# Altium schematic sheet Main.SchDoc (part 2 of 2)
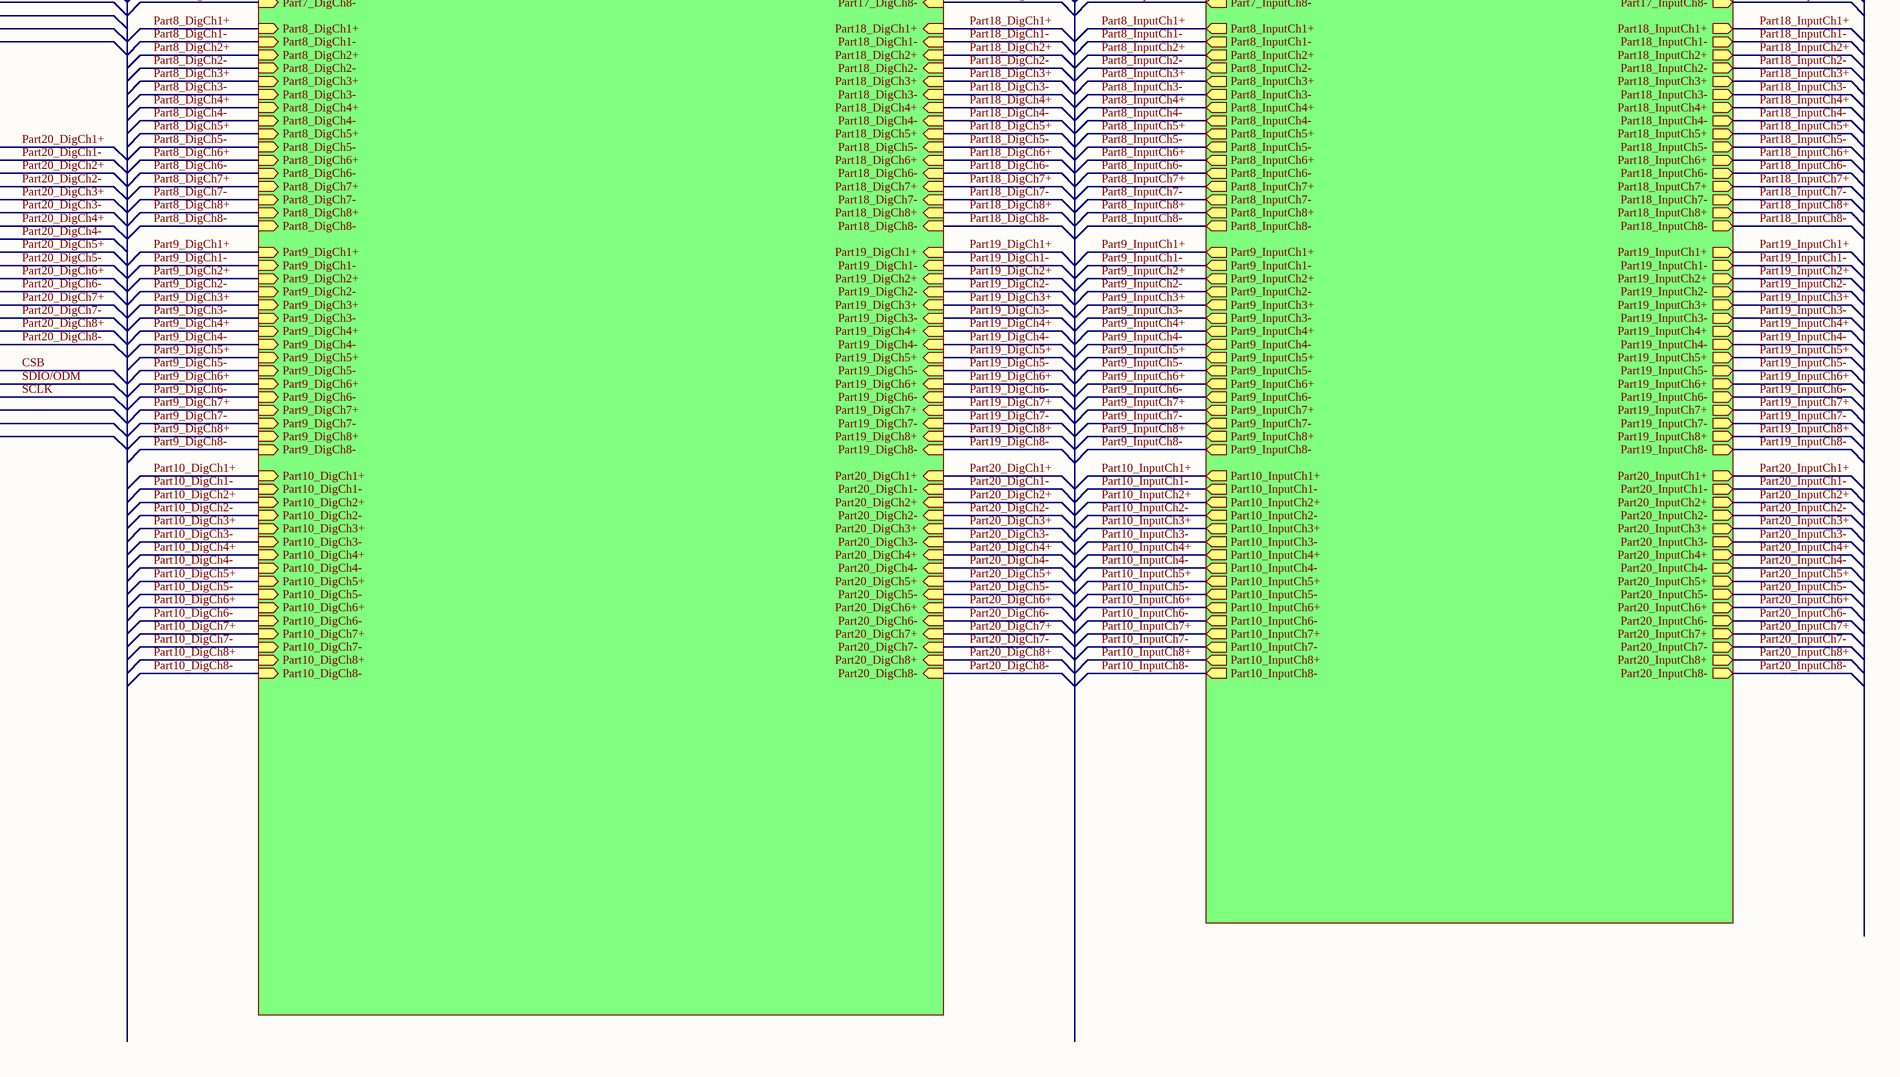
[diagram p4: Main.SchDoc, bottom right]

## Nets
CSB: sheet Part1/CSB, sheet Part5/CSB, sheet Part9/CSB, sheet Part13/CSB, sheet Part17/CSB, sheet Part2/CSB, sheet Part6/CSB, sheet Part10/CSB, sheet Part14/CSB, sheet Part18/CSB, sheet Part3/CSB, sheet Part7/CSB, sheet Part11/CSB, sheet Part15/CSB, sheet Part19/CSB, sheet Part4/CSB, sheet Part8/CSB, sheet Part12/CSB, sheet Part16/CSB, sheet Part20/CSB
Part1_DigCh1+: sheet Processing/Part1_DigCh1+, sheet Part1/Output_ch1+
Part1_DigCh1-: sheet Processing/Part1_DigCh1-, sheet Part1/Output_ch1-
Part1_DigCh2+: sheet Processing/Part1_DigCh2+, sheet Part1/Output_ch2+
Part1_DigCh2-: sheet Processing/Part1_DigCh2-, sheet Part1/Output_ch2-
Part1_DigCh3+: sheet Processing/Part1_DigCh3+, sheet Part1/Output_ch3+
Part1_DigCh3-: sheet Processing/Part1_DigCh3-, sheet Part1/Output_ch3-
Part1_DigCh4+: sheet Processing/Part1_DigCh4+, sheet Part1/Output_ch4+
Part1_DigCh4-: sheet Processing/Part1_DigCh4-, sheet Part1/Output_ch4-
Part1_DigCh5+: sheet Processing/Part1_DigCh5+, sheet Part1/Output_ch5+
Part1_DigCh5-: sheet Processing/Part1_DigCh5-, sheet Part1/Output_ch5-
Part1_DigCh6+: sheet Processing/Part1_DigCh6+, sheet Part1/Output_ch6+
Part1_DigCh6-: sheet Processing/Part1_DigCh6-, sheet Part1/Output_ch6-
Part1_DigCh7+: sheet Processing/Part1_DigCh7+, sheet Part1/Output_ch7+
Part1_DigCh7-: sheet Processing/Part1_DigCh7-, sheet Part1/Output_ch7-
Part1_DigCh8+: sheet Processing/Part1_DigCh8+, sheet Part1/Output_ch8+
Part1_DigCh8-: sheet Processing/Part1_DigCh8-, sheet Part1/Output_ch8-
Part1_InputCh1+: sheet Designator/Part1_InputCh1+, sheet Part1/Input_ch1+
Part1_InputCh1-: sheet Designator/Part1_InputCh1-, sheet Part1/Input_ch1-
Part1_InputCh2+: sheet Designator/Part1_InputCh2+, sheet Part1/Input_ch2+
Part1_InputCh2-: sheet Designator/Part1_InputCh2-, sheet Part1/Input_ch2-
Part1_InputCh3+: sheet Designator/Part1_InputCh3+, sheet Part1/Input_ch3+
Part1_InputCh3-: sheet Designator/Part1_InputCh3-, sheet Part1/Input_ch3-
Part1_InputCh4+: sheet Designator/Part1_InputCh4+, sheet Part1/Input_ch4+
Part1_InputCh4-: sheet Designator/Part1_InputCh4-, sheet Part1/Input_ch4-
Part1_InputCh5+: sheet Designator/Part1_InputCh5+, sheet Part1/Input_ch5+
Part1_InputCh5-: sheet Designator/Part1_InputCh5-, sheet Part1/Input_ch5-
Part1_InputCh6+: sheet Designator/Part1_InputCh6+, sheet Part1/Input_ch6+
Part1_InputCh6-: sheet Designator/Part1_InputCh6-, sheet Part1/Input_ch6-
Part1_InputCh7+: sheet Designator/Part1_InputCh7+, sheet Part1/Input_ch7+
Part1_InputCh7-: sheet Designator/Part1_InputCh7-, sheet Part1/Input_ch7-
Part1_InputCh8+: sheet Designator/Part1_InputCh8+, sheet Part1/Input_ch8+
Part1_InputCh8-: sheet Designator/Part1_InputCh8-, sheet Part1/Input_ch8-
Part2_DigCh1+: sheet Processing/Part2_DigCh1+, sheet Part2/Output_ch1+
Part2_DigCh1-: sheet Processing/Part2_DigCh1-, sheet Part2/Output_ch1-
Part2_DigCh2+: sheet Processing/Part2_DigCh2+, sheet Part2/Output_ch2+
Part2_DigCh2-: sheet Processing/Part2_DigCh2-, sheet Part2/Output_ch2-
Part2_DigCh3+: sheet Processing/Part2_DigCh3+, sheet Part2/Output_ch3+
Part2_DigCh3-: sheet Processing/Part2_DigCh3-, sheet Part2/Output_ch3-
Part2_DigCh4+: sheet Processing/Part2_DigCh4+, sheet Part2/Output_ch4+
Part2_DigCh4-: sheet Processing/Part2_DigCh4-, sheet Part2/Output_ch4-
Part2_DigCh5+: sheet Processing/Part2_DigCh5+, sheet Part2/Output_ch5+
Part2_DigCh5-: sheet Processing/Part2_DigCh5-, sheet Part2/Output_ch5-
Part2_DigCh6+: sheet Processing/Part2_DigCh6+, sheet Part2/Output_ch6+
Part2_DigCh6-: sheet Processing/Part2_DigCh6-, sheet Part2/Output_ch6-
Part2_DigCh7+: sheet Processing/Part2_DigCh7+, sheet Part2/Output_ch7+
Part2_DigCh7-: sheet Processing/Part2_DigCh7-, sheet Part2/Output_ch7-
Part2_DigCh8+: sheet Processing/Part2_DigCh8+, sheet Part2/Output_ch8+
Part2_DigCh8-: sheet Processing/Part2_DigCh8-, sheet Part2/Output_ch8-
Part2_InputCh1+: sheet Designator/Part2_InputCh1+, sheet Part2/Input_ch1+
Part2_InputCh1-: sheet Designator/Part2_InputCh1-, sheet Part2/Input_ch1-
Part2_InputCh2+: sheet Designator/Part2_InputCh2+, sheet Part2/Input_ch2+
Part2_InputCh2-: sheet Designator/Part2_InputCh2-, sheet Part2/Input_ch2-
Part2_InputCh3+: sheet Designator/Part2_InputCh3+, sheet Part2/Input_ch3+
Part2_InputCh3-: sheet Designator/Part2_InputCh3-, sheet Part2/Input_ch3-
Part2_InputCh4+: sheet Designator/Part2_InputCh4+, sheet Part2/Input_ch4+
Part2_InputCh4-: sheet Designator/Part2_InputCh4-, sheet Part2/Input_ch4-
Part2_InputCh5+: sheet Designator/Part2_InputCh5+, sheet Part2/Input_ch5+
Part2_InputCh5-: sheet Designator/Part2_InputCh5-, sheet Part2/Input_ch5-
Part2_InputCh6+: sheet Designator/Part2_InputCh6+, sheet Part2/Input_ch6+
Part2_InputCh6-: sheet Designator/Part2_InputCh6-, sheet Part2/Input_ch6-
Part2_InputCh7+: sheet Designator/Part2_InputCh7+, sheet Part2/Input_ch7+
Part2_InputCh7-: sheet Designator/Part2_InputCh7-, sheet Part2/Input_ch7-
Part2_InputCh8+: sheet Designator/Part2_InputCh8+, sheet Part2/Input_ch8+
Part2_InputCh8-: sheet Designator/Part2_InputCh8-, sheet Part2/Input_ch8-
Part3_DigCh1+: sheet Processing/Part3_DigCh1+, sheet Part3/Output_ch1+
Part3_DigCh1-: sheet Processing/Part3_DigCh1-, sheet Part3/Output_ch1-
Part3_DigCh2+: sheet Processing/Part3_DigCh2+, sheet Part3/Output_ch2+
Part3_DigCh2-: sheet Processing/Part3_DigCh2-, sheet Part3/Output_ch2-
Part3_DigCh3+: sheet Processing/Part3_DigCh3+, sheet Part3/Output_ch3+
Part3_DigCh3-: sheet Processing/Part3_DigCh3-, sheet Part3/Output_ch3-
Part3_DigCh4+: sheet Processing/Part3_DigCh4+, sheet Part3/Output_ch4+
Part3_DigCh4-: sheet Processing/Part3_DigCh4-, sheet Part3/Output_ch4-
Part3_DigCh5+: sheet Processing/Part3_DigCh5+, sheet Part3/Output_ch5+
Part3_DigCh5-: sheet Processing/Part3_DigCh5-, sheet Part3/Output_ch5-
Part3_DigCh6+: sheet Processing/Part3_DigCh6+, sheet Part3/Output_ch6+
Part3_DigCh6-: sheet Processing/Part3_DigCh6-, sheet Part3/Output_ch6-
Part3_DigCh7+: sheet Processing/Part3_DigCh7+, sheet Part3/Output_ch7+
Part3_DigCh7-: sheet Processing/Part3_DigCh7-, sheet Part3/Output_ch7-
Part3_DigCh8+: sheet Processing/Part3_DigCh8+, sheet Part3/Output_ch8+
Part3_DigCh8-: sheet Processing/Part3_DigCh8-, sheet Part3/Output_ch8-
Part3_InputCh1+: sheet Designator/Part3_InputCh1+, sheet Part3/Input_ch1+
Part3_InputCh1-: sheet Designator/Part3_InputCh1-, sheet Part3/Input_ch1-
Part3_InputCh2+: sheet Designator/Part3_InputCh2+, sheet Part3/Input_ch2+
Part3_InputCh2-: sheet Designator/Part3_InputCh2-, sheet Part3/Input_ch2-
Part3_InputCh3+: sheet Designator/Part3_InputCh3+, sheet Part3/Input_ch3+
Part3_InputCh3-: sheet Designator/Part3_InputCh3-, sheet Part3/Input_ch3-
Part3_InputCh4+: sheet Designator/Part3_InputCh4+, sheet Part3/Input_ch4+
Part3_InputCh4-: sheet Designator/Part3_InputCh4-, sheet Part3/Input_ch4-
Part3_InputCh5+: sheet Designator/Part3_InputCh5+, sheet Part3/Input_ch5+
Part3_InputCh5-: sheet Designator/Part3_InputCh5-, sheet Part3/Input_ch5-
Part3_InputCh6+: sheet Designator/Part3_InputCh6+, sheet Part3/Input_ch6+
Part3_InputCh6-: sheet Designator/Part3_InputCh6-, sheet Part3/Input_ch6-
Part3_InputCh7+: sheet Designator/Part3_InputCh7+, sheet Part3/Input_ch7+
Part3_InputCh7-: sheet Designator/Part3_InputCh7-, sheet Part3/Input_ch7-
Part3_InputCh8+: sheet Designator/Part3_InputCh8+, sheet Part3/Input_ch8+
Part3_InputCh8-: sheet Designator/Part3_InputCh8-, sheet Part3/Input_ch8-
Part4_DigCh1+: sheet Processing/Part4_DigCh1+, sheet Part4/Output_ch1+
Part4_DigCh1-: sheet Processing/Part4_DigCh1-, sheet Part4/Output_ch1-
Part4_DigCh2+: sheet Processing/Part4_DigCh2+, sheet Part4/Output_ch2+
Part4_DigCh2-: sheet Processing/Part4_DigCh2-, sheet Part4/Output_ch2-
Part4_DigCh3+: sheet Processing/Part4_DigCh3+, sheet Part4/Output_ch3+
Part4_DigCh3-: sheet Processing/Part4_DigCh3-, sheet Part4/Output_ch3-
Part4_DigCh4+: sheet Processing/Part4_DigCh4+, sheet Part4/Output_ch4+
Part4_DigCh4-: sheet Processing/Part4_DigCh4-, sheet Part4/Output_ch4-
Part4_DigCh5+: sheet Processing/Part4_DigCh5+, sheet Part4/Output_ch5+
Part4_DigCh5-: sheet Processing/Part4_DigCh5-, sheet Part4/Output_ch5-
Part4_DigCh6+: sheet Processing/Part4_DigCh6+, sheet Part4/Output_ch6+
Part4_DigCh6-: sheet Processing/Part4_DigCh6-, sheet Part4/Output_ch6-
Part4_DigCh7+: sheet Processing/Part4_DigCh7+, sheet Part4/Output_ch7+
Part4_DigCh7-: sheet Processing/Part4_DigCh7-, sheet Part4/Output_ch7-
Part4_DigCh8+: sheet Processing/Part4_DigCh8+, sheet Part4/Output_ch8+
Part4_DigCh8-: sheet Processing/Part4_DigCh8-, sheet Part4/Output_ch8-
Part4_InputCh1+: sheet Designator/Part4_InputCh1+, sheet Part4/Input_ch1+
Part4_InputCh1-: sheet Designator/Part4_InputCh1-, sheet Part4/Input_ch1-
Part4_InputCh2+: sheet Designator/Part4_InputCh2+, sheet Part4/Input_ch2+
Part4_InputCh2-: sheet Designator/Part4_InputCh2-, sheet Part4/Input_ch2-
Part4_InputCh3+: sheet Designator/Part4_InputCh3+, sheet Part4/Input_ch3+
Part4_InputCh3-: sheet Designator/Part4_InputCh3-, sheet Part4/Input_ch3-
Part4_InputCh4+: sheet Designator/Part4_InputCh4+, sheet Part4/Input_ch4+
Part4_InputCh4-: sheet Designator/Part4_InputCh4-, sheet Part4/Input_ch4-
Part4_InputCh5+: sheet Designator/Part4_InputCh5+, sheet Part4/Input_ch5+
Part4_InputCh5-: sheet Designator/Part4_InputCh5-, sheet Part4/Input_ch5-
Part4_InputCh6+: sheet Designator/Part4_InputCh6+, sheet Part4/Input_ch6+
Part4_InputCh6-: sheet Designator/Part4_InputCh6-, sheet Part4/Input_ch6-
Part4_InputCh7+: sheet Designator/Part4_InputCh7+, sheet Part4/Input_ch7+
Part4_InputCh7-: sheet Designator/Part4_InputCh7-, sheet Part4/Input_ch7-
Part4_InputCh8+: sheet Designator/Part4_InputCh8+, sheet Part4/Input_ch8+
Part4_InputCh8-: sheet Designator/Part4_InputCh8-, sheet Part4/Input_ch8-
Part5_DigCh1+: sheet Processing/Part5_DigCh1+, sheet Part5/Output_ch1+
Part5_DigCh1-: sheet Processing/Part5_DigCh1-, sheet Part5/Output_ch1-
Part5_DigCh2+: sheet Processing/Part5_DigCh2+, sheet Part5/Output_ch2+
Part5_DigCh2-: sheet Processing/Part5_DigCh2-, sheet Part5/Output_ch2-
Part5_DigCh3+: sheet Processing/Part5_DigCh3+, sheet Part5/Output_ch3+
Part5_DigCh3-: sheet Processing/Part5_DigCh3-, sheet Part5/Output_ch3-
Part5_DigCh4+: sheet Processing/Part5_DigCh4+, sheet Part5/Output_ch4+
Part5_DigCh4-: sheet Processing/Part5_DigCh4-, sheet Part5/Output_ch4-
Part5_DigCh5+: sheet Processing/Part5_DigCh5+, sheet Part5/Output_ch5+
Part5_DigCh5-: sheet Processing/Part5_DigCh5-, sheet Part5/Output_ch5-
Part5_DigCh6+: sheet Processing/Part5_DigCh6+, sheet Part5/Output_ch6+
Part5_DigCh6-: sheet Processing/Part5_DigCh6-, sheet Part5/Output_ch6-
Part5_DigCh7+: sheet Processing/Part5_DigCh7+, sheet Part5/Output_ch7+
Part5_DigCh7-: sheet Processing/Part5_DigCh7-, sheet Part5/Output_ch7-
Part5_DigCh8+: sheet Processing/Part5_DigCh8+, sheet Part5/Output_ch8+
Part5_DigCh8-: sheet Processing/Part5_DigCh8-, sheet Part5/Output_ch8-
Part5_InputCh1+: sheet Designator/Part5_InputCh1+, sheet Part5/Input_ch1+
Part5_InputCh1-: sheet Designator/Part5_InputCh1-, sheet Part5/Input_ch1-
Part5_InputCh2+: sheet Designator/Part5_InputCh2+, sheet Part5/Input_ch2+
Part5_InputCh2-: sheet Designator/Part5_InputCh2-, sheet Part5/Input_ch2-
Part5_InputCh3+: sheet Designator/Part5_InputCh3+, sheet Part5/Input_ch3+
Part5_InputCh3-: sheet Designator/Part5_InputCh3-, sheet Part5/Input_ch3-
Part5_InputCh4+: sheet Designator/Part5_InputCh4+, sheet Part5/Input_ch4+
Part5_InputCh4-: sheet Designator/Part5_InputCh4-, sheet Part5/Input_ch4-
Part5_InputCh5+: sheet Designator/Part5_InputCh5+, sheet Part5/Input_ch5+
Part5_InputCh5-: sheet Designator/Part5_InputCh5-, sheet Part5/Input_ch5-
Part5_InputCh6+: sheet Designator/Part5_InputCh6+, sheet Part5/Input_ch6+
Part5_InputCh6-: sheet Designator/Part5_InputCh6-, sheet Part5/Input_ch6-
Part5_InputCh7+: sheet Designator/Part5_InputCh7+, sheet Part5/Input_ch7+
Part5_InputCh7-: sheet Designator/Part5_InputCh7-, sheet Part5/Input_ch7-
Part5_InputCh8+: sheet Designator/Part5_InputCh8+, sheet Part5/Input_ch8+
Part5_InputCh8-: sheet Designator/Part5_InputCh8-, sheet Part5/Input_ch8-
Part6_DigCh1+: sheet Processing/Part6_DigCh1+, sheet Part6/Output_ch1+
Part6_DigCh1-: sheet Processing/Part6_DigCh1-, sheet Part6/Output_ch1-
Part6_DigCh2+: sheet Processing/Part6_DigCh2+, sheet Part6/Output_ch2+
Part6_DigCh2-: sheet Processing/Part6_DigCh2-, sheet Part6/Output_ch2-
Part6_DigCh3+: sheet Processing/Part6_DigCh3+, sheet Part6/Output_ch3+
Part6_DigCh3-: sheet Processing/Part6_DigCh3-, sheet Part6/Output_ch3-
Part6_DigCh4+: sheet Processing/Part6_DigCh4+, sheet Part6/Output_ch4+
Part6_DigCh4-: sheet Processing/Part6_DigCh4-, sheet Part6/Output_ch4-
Part6_DigCh5+: sheet Processing/Part6_DigCh5+, sheet Part6/Output_ch5+
Part6_DigCh5-: sheet Processing/Part6_DigCh5-, sheet Part6/Output_ch5-
Part6_DigCh6+: sheet Processing/Part6_DigCh6+, sheet Part6/Output_ch6+
Part6_DigCh6-: sheet Processing/Part6_DigCh6-, sheet Part6/Output_ch6-
Part6_DigCh7+: sheet Processing/Part6_DigCh7+, sheet Part6/Output_ch7+
Part6_DigCh7-: sheet Processing/Part6_DigCh7-, sheet Part6/Output_ch7-
Part6_DigCh8+: sheet Processing/Part6_DigCh8+, sheet Part6/Output_ch8+
Part6_DigCh8-: sheet Processing/Part6_DigCh8-, sheet Part6/Output_ch8-
Part6_InputCh1+: sheet Designator/Part6_InputCh1+, sheet Part6/Input_ch1+
Part6_InputCh1-: sheet Designator/Part6_InputCh1-, sheet Part6/Input_ch1-
Part6_InputCh2+: sheet Designator/Part6_InputCh2+, sheet Part6/Input_ch2+
Part6_InputCh2-: sheet Designator/Part6_InputCh2-, sheet Part6/Input_ch2-
Part6_InputCh3+: sheet Designator/Part6_InputCh3+, sheet Part6/Input_ch3+
Part6_InputCh3-: sheet Designator/Part6_InputCh3-, sheet Part6/Input_ch3-
Part6_InputCh4+: sheet Designator/Part6_InputCh4+, sheet Part6/Input_ch4+
Part6_InputCh4-: sheet Designator/Part6_InputCh4-, sheet Part6/Input_ch4-
Part6_InputCh5+: sheet Designator/Part6_InputCh5+, sheet Part6/Input_ch5+
Part6_InputCh5-: sheet Designator/Part6_InputCh5-, sheet Part6/Input_ch5-
Part6_InputCh6+: sheet Designator/Part6_InputCh6+, sheet Part6/Input_ch6+
Part6_InputCh6-: sheet Designator/Part6_InputCh6-, sheet Part6/Input_ch6-
Part6_InputCh7+: sheet Designator/Part6_InputCh7+, sheet Part6/Input_ch7+
Part6_InputCh7-: sheet Designator/Part6_InputCh7-, sheet Part6/Input_ch7-
Part6_InputCh8+: sheet Designator/Part6_InputCh8+, sheet Part6/Input_ch8+
Part6_InputCh8-: sheet Designator/Part6_InputCh8-, sheet Part6/Input_ch8-
Part7_DigCh1+: sheet Processing/Part7_DigCh1+, sheet Part7/Output_ch1+
Part7_DigCh1-: sheet Processing/Part7_DigCh1-, sheet Part7/Output_ch1-
Part7_DigCh2+: sheet Processing/Part7_DigCh2+, sheet Part7/Output_ch2+
Part7_DigCh2-: sheet Processing/Part7_DigCh2-, sheet Part7/Output_ch2-
Part7_DigCh3+: sheet Processing/Part7_DigCh3+, sheet Part7/Output_ch3+
Part7_DigCh3-: sheet Processing/Part7_DigCh3-, sheet Part7/Output_ch3-
Part7_DigCh4+: sheet Processing/Part7_DigCh4+, sheet Part7/Output_ch4+
Part7_DigCh4-: sheet Processing/Part7_DigCh4-, sheet Part7/Output_ch4-
Part7_DigCh5+: sheet Processing/Part7_DigCh5+, sheet Part7/Output_ch5+
Part7_DigCh5-: sheet Processing/Part7_DigCh5-, sheet Part7/Output_ch5-
Part7_DigCh6+: sheet Processing/Part7_DigCh6+, sheet Part7/Output_ch6+
Part7_DigCh6-: sheet Processing/Part7_DigCh6-, sheet Part7/Output_ch6-
Part7_DigCh7+: sheet Processing/Part7_DigCh7+, sheet Part7/Output_ch7+
Part7_DigCh7-: sheet Processing/Part7_DigCh7-, sheet Part7/Output_ch7-
Part7_DigCh8+: sheet Processing/Part7_DigCh8+, sheet Part7/Output_ch8+
Part7_DigCh8-: sheet Processing/Part7_DigCh8-, sheet Part7/Output_ch8-
Part7_InputCh1+: sheet Designator/Part7_InputCh1+, sheet Part7/Input_ch1+
Part7_InputCh1-: sheet Designator/Part7_InputCh1-, sheet Part7/Input_ch1-
Part7_InputCh2+: sheet Designator/Part7_InputCh2+, sheet Part7/Input_ch2+
Part7_InputCh2-: sheet Designator/Part7_InputCh2-, sheet Part7/Input_ch2-
Part7_InputCh3+: sheet Designator/Part7_InputCh3+, sheet Part7/Input_ch3+
Part7_InputCh3-: sheet Designator/Part7_InputCh3-, sheet Part7/Input_ch3-
Part7_InputCh4+: sheet Designator/Part7_InputCh4+, sheet Part7/Input_ch4+
Part7_InputCh4-: sheet Designator/Part7_InputCh4-, sheet Part7/Input_ch4-
Part7_InputCh5+: sheet Designator/Part7_InputCh5+, sheet Part7/Input_ch5+
Part7_InputCh5-: sheet Designator/Part7_InputCh5-, sheet Part7/Input_ch5-
Part7_InputCh6+: sheet Designator/Part7_InputCh6+, sheet Part7/Input_ch6+
Part7_InputCh6-: sheet Designator/Part7_InputCh6-, sheet Part7/Input_ch6-
Part7_InputCh7+: sheet Designator/Part7_InputCh7+, sheet Part7/Input_ch7+
Part7_InputCh7-: sheet Designator/Part7_InputCh7-, sheet Part7/Input_ch7-
Part7_InputCh8+: sheet Designator/Part7_InputCh8+, sheet Part7/Input_ch8+
Part7_InputCh8-: sheet Designator/Part7_InputCh8-, sheet Part7/Input_ch8-
Part8_DigCh1+: sheet Processing/Part8_DigCh1+, sheet Part8/Output_ch1+
Part8_DigCh1-: sheet Processing/Part8_DigCh1-, sheet Part8/Output_ch1-
Part8_DigCh2+: sheet Processing/Part8_DigCh2+, sheet Part8/Output_ch2+
Part8_DigCh2-: sheet Processing/Part8_DigCh2-, sheet Part8/Output_ch2-
Part8_DigCh3+: sheet Processing/Part8_DigCh3+, sheet Part8/Output_ch3+
Part8_DigCh3-: sheet Processing/Part8_DigCh3-, sheet Part8/Output_ch3-
Part8_DigCh4+: sheet Processing/Part8_DigCh4+, sheet Part8/Output_ch4+
Part8_DigCh4-: sheet Processing/Part8_DigCh4-, sheet Part8/Output_ch4-
Part8_DigCh5+: sheet Processing/Part8_DigCh5+, sheet Part8/Output_ch5+
Part8_DigCh5-: sheet Processing/Part8_DigCh5-, sheet Part8/Output_ch5-
Part8_DigCh6+: sheet Processing/Part8_DigCh6+, sheet Part8/Output_ch6+
Part8_DigCh6-: sheet Processing/Part8_DigCh6-, sheet Part8/Output_ch6-
Part8_DigCh7+: sheet Processing/Part8_DigCh7+, sheet Part8/Output_ch7+
Part8_DigCh7-: sheet Processing/Part8_DigCh7-, sheet Part8/Output_ch7-
Part8_DigCh8+: sheet Processing/Part8_DigCh8+, sheet Part8/Output_ch8+
Part8_DigCh8-: sheet Processing/Part8_DigCh8-, sheet Part8/Output_ch8-
Part8_InputCh1+: sheet Designator/Part8_InputCh1+, sheet Part8/Input_ch1+
Part8_InputCh1-: sheet Designator/Part8_InputCh1-, sheet Part8/Input_ch1-
Part8_InputCh2+: sheet Designator/Part8_InputCh2+, sheet Part8/Input_ch2+
Part8_InputCh2-: sheet Designator/Part8_InputCh2-, sheet Part8/Input_ch2-
Part8_InputCh3+: sheet Designator/Part8_InputCh3+, sheet Part8/Input_ch3+
Part8_InputCh3-: sheet Designator/Part8_InputCh3-, sheet Part8/Input_ch3-
Part8_InputCh4+: sheet Designator/Part8_InputCh4+, sheet Part8/Input_ch4+
Part8_InputCh4-: sheet Designator/Part8_InputCh4-, sheet Part8/Input_ch4-
Part8_InputCh5+: sheet Designator/Part8_InputCh5+, sheet Part8/Input_ch5+
Part8_InputCh5-: sheet Designator/Part8_InputCh5-, sheet Part8/Input_ch5-
Part8_InputCh6+: sheet Designator/Part8_InputCh6+, sheet Part8/Input_ch6+
Part8_InputCh6-: sheet Designator/Part8_InputCh6-, sheet Part8/Input_ch6-
Part8_InputCh7+: sheet Designator/Part8_InputCh7+, sheet Part8/Input_ch7+
Part8_InputCh7-: sheet Designator/Part8_InputCh7-, sheet Part8/Input_ch7-
Part8_InputCh8+: sheet Designator/Part8_InputCh8+, sheet Part8/Input_ch8+
Part8_InputCh8-: sheet Designator/Part8_InputCh8-, sheet Part8/Input_ch8-
Part9_DigCh1+: sheet Processing/Part9_DigCh1+, sheet Part9/Output_ch1+
Part9_DigCh1-: sheet Processing/Part9_DigCh1-, sheet Part9/Output_ch1-
Part9_DigCh2+: sheet Processing/Part9_DigCh2+, sheet Part9/Output_ch2+
Part9_DigCh2-: sheet Processing/Part9_DigCh2-, sheet Part9/Output_ch2-
Part9_DigCh3+: sheet Processing/Part9_DigCh3+, sheet Part9/Output_ch3+
Part9_DigCh3-: sheet Processing/Part9_DigCh3-, sheet Part9/Output_ch3-
Part9_DigCh4+: sheet Processing/Part9_DigCh4+, sheet Part9/Output_ch4+
Part9_DigCh4-: sheet Processing/Part9_DigCh4-, sheet Part9/Output_ch4-
Part9_DigCh5+: sheet Processing/Part9_DigCh5+, sheet Part9/Output_ch5+
Part9_DigCh5-: sheet Processing/Part9_DigCh5-, sheet Part9/Output_ch5-
Part9_DigCh6+: sheet Processing/Part9_DigCh6+, sheet Part9/Output_ch6+
Part9_DigCh6-: sheet Processing/Part9_DigCh6-, sheet Part9/Output_ch6-
Part9_DigCh7+: sheet Processing/Part9_DigCh7+, sheet Part9/Output_ch7+
Part9_DigCh7-: sheet Processing/Part9_DigCh7-, sheet Part9/Output_ch7-
Part9_DigCh8+: sheet Processing/Part9_DigCh8+, sheet Part9/Output_ch8+
Part9_DigCh8-: sheet Processing/Part9_DigCh8-, sheet Part9/Output_ch8-
Part9_InputCh1+: sheet Designator/Part9_InputCh1+, sheet Part9/Input_ch1+
Part9_InputCh1-: sheet Designator/Part9_InputCh1-, sheet Part9/Input_ch1-
Part9_InputCh2+: sheet Designator/Part9_InputCh2+, sheet Part9/Input_ch2+
Part9_InputCh2-: sheet Designator/Part9_InputCh2-, sheet Part9/Input_ch2-
Part9_InputCh3+: sheet Designator/Part9_InputCh3+, sheet Part9/Input_ch3+
Part9_InputCh3-: sheet Designator/Part9_InputCh3-, sheet Part9/Input_ch3-
Part9_InputCh4+: sheet Designator/Part9_InputCh4+, sheet Part9/Input_ch4+
Part9_InputCh4-: sheet Designator/Part9_InputCh4-, sheet Part9/Input_ch4-
Part9_InputCh5+: sheet Designator/Part9_InputCh5+, sheet Part9/Input_ch5+
Part9_InputCh5-: sheet Designator/Part9_InputCh5-, sheet Part9/Input_ch5-
Part9_InputCh6+: sheet Designator/Part9_InputCh6+, sheet Part9/Input_ch6+
Part9_InputCh6-: sheet Designator/Part9_InputCh6-, sheet Part9/Input_ch6-
Part9_InputCh7+: sheet Designator/Part9_InputCh7+, sheet Part9/Input_ch7+
Part9_InputCh7-: sheet Designator/Part9_InputCh7-, sheet Part9/Input_ch7-
Part9_InputCh8+: sheet Designator/Part9_InputCh8+, sheet Part9/Input_ch8+
Part9_InputCh8-: sheet Designator/Part9_InputCh8-, sheet Part9/Input_ch8-
Part10_DigCh1+: sheet Processing/Part10_DigCh1+, sheet Part10/Output_ch1+
Part10_DigCh1-: sheet Processing/Part10_DigCh1-, sheet Part10/Output_ch1-
Part10_DigCh2+: sheet Processing/Part10_DigCh2+, sheet Part10/Output_ch2+
Part10_DigCh2-: sheet Processing/Part10_DigCh2-, sheet Part10/Output_ch2-
Part10_DigCh3+: sheet Processing/Part10_DigCh3+, sheet Part10/Output_ch3+
Part10_DigCh3-: sheet Processing/Part10_DigCh3-, sheet Part10/Output_ch3-
Part10_DigCh4+: sheet Processing/Part10_DigCh4+, sheet Part10/Output_ch4+
Part10_DigCh4-: sheet Processing/Part10_DigCh4-, sheet Part10/Output_ch4-
Part10_DigCh5+: sheet Processing/Part10_DigCh5+, sheet Part10/Output_ch5+
Part10_DigCh5-: sheet Processing/Part10_DigCh5-, sheet Part10/Output_ch5-
Part10_DigCh6+: sheet Processing/Part10_DigCh6+, sheet Part10/Output_ch6+
Part10_DigCh6-: sheet Processing/Part10_DigCh6-, sheet Part10/Output_ch6-
Part10_DigCh7+: sheet Processing/Part10_DigCh7+, sheet Part10/Output_ch7+
Part10_DigCh7-: sheet Processing/Part10_DigCh7-, sheet Part10/Output_ch7-
Part10_DigCh8+: sheet Processing/Part10_DigCh8+, sheet Part10/Output_ch8+
Part10_DigCh8-: sheet Processing/Part10_DigCh8-, sheet Part10/Output_ch8-
Part10_InputCh1+: sheet Designator/Part10_InputCh1+, sheet Part10/Input_ch1+
Part10_InputCh1-: sheet Designator/Part10_InputCh1-, sheet Part10/Input_ch1-
Part10_InputCh2+: sheet Designator/Part10_InputCh2+, sheet Part10/Input_ch2+
Part10_InputCh2-: sheet Designator/Part10_InputCh2-, sheet Part10/Input_ch2-
Part10_InputCh3+: sheet Designator/Part10_InputCh3+, sheet Part10/Input_ch3+
Part10_InputCh3-: sheet Designator/Part10_InputCh3-, sheet Part10/Input_ch3-
Part10_InputCh4+: sheet Designator/Part10_InputCh4+, sheet Part10/Input_ch4+
Part10_InputCh4-: sheet Designator/Part10_InputCh4-, sheet Part10/Input_ch4-
Part10_InputCh5+: sheet Designator/Part10_InputCh5+, sheet Part10/Input_ch5+
Part10_InputCh5-: sheet Designator/Part10_InputCh5-, sheet Part10/Input_ch5-
Part10_InputCh6+: sheet Designator/Part10_InputCh6+, sheet Part10/Input_ch6+
Part10_InputCh6-: sheet Designator/Part10_InputCh6-, sheet Part10/Input_ch6-
Part10_InputCh7+: sheet Designator/Part10_InputCh7+, sheet Part10/Input_ch7+
Part10_InputCh7-: sheet Designator/Part10_InputCh7-, sheet Part10/Input_ch7-
Part10_InputCh8+: sheet Designator/Part10_InputCh8+, sheet Part10/Input_ch8+
Part10_InputCh8-: sheet Designator/Part10_InputCh8-, sheet Part10/Input_ch8-
Part11_DigCh1+: sheet Processing/Part11_DigCh1+, sheet Part11/Output_ch1+
Part11_DigCh1-: sheet Processing/Part11_DigCh1-, sheet Part11/Output_ch1-
Part11_DigCh2+: sheet Processing/Part11_DigCh2+, sheet Part11/Output_ch2+
Part11_DigCh2-: sheet Processing/Part11_DigCh2-, sheet Part11/Output_ch2-
Part11_DigCh3+: sheet Processing/Part11_DigCh3+, sheet Part11/Output_ch3+
Part11_DigCh3-: sheet Processing/Part11_DigCh3-, sheet Part11/Output_ch3-
Part11_DigCh4+: sheet Processing/Part11_DigCh4+, sheet Part11/Output_ch4+
Part11_DigCh4-: sheet Processing/Part11_DigCh4-, sheet Part11/Output_ch4-
Part11_DigCh5+: sheet Processing/Part11_DigCh5+, sheet Part11/Output_ch5+
Part11_DigCh5-: sheet Processing/Part11_DigCh5-, sheet Part11/Output_ch5-
Part11_DigCh6+: sheet Processing/Part11_DigCh6+, sheet Part11/Output_ch6+
Part11_DigCh6-: sheet Processing/Part11_DigCh6-, sheet Part11/Output_ch6-
Part11_DigCh7+: sheet Processing/Part11_DigCh7+, sheet Part11/Output_ch7+
Part11_DigCh7-: sheet Processing/Part11_DigCh7-, sheet Part11/Output_ch7-
Part11_DigCh8+: sheet Processing/Part11_DigCh8+, sheet Part11/Output_ch8+
Part11_DigCh8-: sheet Processing/Part11_DigCh8-, sheet Part11/Output_ch8-
Part11_InputCh1+: sheet Designator/Part11_InputCh1+, sheet Part11/Input_ch1+
Part11_InputCh1-: sheet Designator/Part11_InputCh1-, sheet Part11/Input_ch1-
Part11_InputCh2+: sheet Designator/Part11_InputCh2+, sheet Part11/Input_ch2+
Part11_InputCh2-: sheet Designator/Part11_InputCh2-, sheet Part11/Input_ch2-
Part11_InputCh3+: sheet Designator/Part11_InputCh3+, sheet Part11/Input_ch3+
Part11_InputCh3-: sheet Designator/Part11_InputCh3-, sheet Part11/Input_ch3-
Part11_InputCh4+: sheet Designator/Part11_InputCh4+, sheet Part11/Input_ch4+
Part11_InputCh4-: sheet Designator/Part11_InputCh4-, sheet Part11/Input_ch4-
Part11_InputCh5+: sheet Designator/Part11_InputCh5+, sheet Part11/Input_ch5+
Part11_InputCh5-: sheet Designator/Part11_InputCh5-, sheet Part11/Input_ch5-
Part11_InputCh6+: sheet Designator/Part11_InputCh6+, sheet Part11/Input_ch6+
Part11_InputCh6-: sheet Designator/Part11_InputCh6-, sheet Part11/Input_ch6-
Part11_InputCh7+: sheet Designator/Part11_InputCh7+, sheet Part11/Input_ch7+
Part11_InputCh7-: sheet Designator/Part11_InputCh7-, sheet Part11/Input_ch7-
Part11_InputCh8+: sheet Designator/Part11_InputCh8+, sheet Part11/Input_ch8+
Part11_InputCh8-: sheet Designator/Part11_InputCh8-, sheet Part11/Input_ch8-
Part12_DigCh1+: sheet Processing/Part12_DigCh1+, sheet Part12/Output_ch1+
Part12_DigCh1-: sheet Processing/Part12_DigCh1-, sheet Part12/Output_ch1-
Part12_DigCh2+: sheet Processing/Part12_DigCh2+, sheet Part12/Output_ch2+
Part12_DigCh2-: sheet Processing/Part12_DigCh2-, sheet Part12/Output_ch2-
Part12_DigCh3+: sheet Processing/Part12_DigCh3+, sheet Part12/Output_ch3+
Part12_DigCh3-: sheet Processing/Part12_DigCh3-, sheet Part12/Output_ch3-
Part12_DigCh4+: sheet Processing/Part12_DigCh4+, sheet Part12/Output_ch4+
Part12_DigCh4-: sheet Processing/Part12_DigCh4-, sheet Part12/Output_ch4-
Part12_DigCh5+: sheet Processing/Part12_DigCh5+, sheet Part12/Output_ch5+
Part12_DigCh5-: sheet Processing/Part12_DigCh5-, sheet Part12/Output_ch5-
Part12_DigCh6+: sheet Processing/Part12_DigCh6+, sheet Part12/Output_ch6+
Part12_DigCh6-: sheet Processing/Part12_DigCh6-, sheet Part12/Output_ch6-
Part12_DigCh7+: sheet Processing/Part12_DigCh7+, sheet Part12/Output_ch7+
Part12_DigCh7-: sheet Processing/Part12_DigCh7-, sheet Part12/Output_ch7-
Part12_DigCh8+: sheet Processing/Part12_DigCh8+, sheet Part12/Output_ch8+
Part12_DigCh8-: sheet Processing/Part12_DigCh8-, sheet Part12/Output_ch8-
Part12_InputCh1+: sheet Designator/Part12_InputCh1+, sheet Part12/Input_ch1+
Part12_InputCh1-: sheet Designator/Part12_InputCh1-, sheet Part12/Input_ch1-
Part12_InputCh2+: sheet Designator/Part12_InputCh2+, sheet Part12/Input_ch2+
Part12_InputCh2-: sheet Designator/Part12_InputCh2-, sheet Part12/Input_ch2-
Part12_InputCh3+: sheet Designator/Part12_InputCh3+, sheet Part12/Input_ch3+
Part12_InputCh3-: sheet Designator/Part12_InputCh3-, sheet Part12/Input_ch3-
Part12_InputCh4+: sheet Designator/Part12_InputCh4+, sheet Part12/Input_ch4+
Part12_InputCh4-: sheet Designator/Part12_InputCh4-, sheet Part12/Input_ch4-
Part12_InputCh5+: sheet Designator/Part12_InputCh5+, sheet Part12/Input_ch5+
Part12_InputCh5-: sheet Designator/Part12_InputCh5-, sheet Part12/Input_ch5-
Part12_InputCh6+: sheet Designator/Part12_InputCh6+, sheet Part12/Input_ch6+
Part12_InputCh6-: sheet Designator/Part12_InputCh6-, sheet Part12/Input_ch6-
Part12_InputCh7+: sheet Designator/Part12_InputCh7+, sheet Part12/Input_ch7+
Part12_InputCh7-: sheet Designator/Part12_InputCh7-, sheet Part12/Input_ch7-
Part12_InputCh8+: sheet Designator/Part12_InputCh8+, sheet Part12/Input_ch8+
Part12_InputCh8-: sheet Designator/Part12_InputCh8-, sheet Part12/Input_ch8-
Part13_DigCh1+: sheet Processing/Part13_DigCh1+, sheet Part13/Output_ch1+
Part13_DigCh1-: sheet Processing/Part13_DigCh1-, sheet Part13/Output_ch1-
Part13_DigCh2+: sheet Processing/Part13_DigCh2+, sheet Part13/Output_ch2+
Part13_DigCh2-: sheet Processing/Part13_DigCh2-, sheet Part13/Output_ch2-
Part13_DigCh3+: sheet Processing/Part13_DigCh3+, sheet Part13/Output_ch3+
Part13_DigCh3-: sheet Processing/Part13_DigCh3-, sheet Part13/Output_ch3-
Part13_DigCh4+: sheet Processing/Part13_DigCh4+, sheet Part13/Output_ch4+
Part13_DigCh4-: sheet Processing/Part13_DigCh4-, sheet Part13/Output_ch4-
Part13_DigCh5+: sheet Processing/Part13_DigCh5+, sheet Part13/Output_ch5+
Part13_DigCh5-: sheet Processing/Part13_DigCh5-, sheet Part13/Output_ch5-
Part13_DigCh6+: sheet Processing/Part13_DigCh6+, sheet Part13/Output_ch6+
Part13_DigCh6-: sheet Processing/Part13_DigCh6-, sheet Part13/Output_ch6-
Part13_DigCh7+: sheet Processing/Part13_DigCh7+, sheet Part13/Output_ch7+
Part13_DigCh7-: sheet Processing/Part13_DigCh7-, sheet Part13/Output_ch7-
Part13_DigCh8+: sheet Processing/Part13_DigCh8+, sheet Part13/Output_ch8+
Part13_DigCh8-: sheet Processing/Part13_DigCh8-, sheet Part13/Output_ch8-
Part13_InputCh1+: sheet Designator/Part13_InputCh1+, sheet Part13/Input_ch1+
Part13_InputCh1-: sheet Designator/Part13_InputCh1-, sheet Part13/Input_ch1-
Part13_InputCh2+: sheet Designator/Part13_InputCh2+, sheet Part13/Input_ch2+
Part13_InputCh2-: sheet Designator/Part13_InputCh2-, sheet Part13/Input_ch2-
Part13_InputCh3+: sheet Designator/Part13_InputCh3+, sheet Part13/Input_ch3+
Part13_InputCh3-: sheet Designator/Part13_InputCh3-, sheet Part13/Input_ch3-
Part13_InputCh4+: sheet Designator/Part13_InputCh4+, sheet Part13/Input_ch4+
Part13_InputCh4-: sheet Designator/Part13_InputCh4-, sheet Part13/Input_ch4-
Part13_InputCh5+: sheet Designator/Part13_InputCh5+, sheet Part13/Input_ch5+
Part13_InputCh5-: sheet Designator/Part13_InputCh5-, sheet Part13/Input_ch5-
Part13_InputCh6+: sheet Designator/Part13_InputCh6+, sheet Part13/Input_ch6+
Part13_InputCh6-: sheet Designator/Part13_InputCh6-, sheet Part13/Input_ch6-
Part13_InputCh7+: sheet Designator/Part13_InputCh7+, sheet Part13/Input_ch7+
Part13_InputCh7-: sheet Designator/Part13_InputCh7-, sheet Part13/Input_ch7-
Part13_InputCh8+: sheet Designator/Part13_InputCh8+, sheet Part13/Input_ch8+
Part13_InputCh8-: sheet Designator/Part13_InputCh8-, sheet Part13/Input_ch8-
Part14_DigCh1+: sheet Processing/Part14_DigCh1+, sheet Part14/Output_ch1+
Part14_DigCh1-: sheet Processing/Part14_DigCh1-, sheet Part14/Output_ch1-
Part14_DigCh2+: sheet Processing/Part14_DigCh2+, sheet Part14/Output_ch2+
Part14_DigCh2-: sheet Processing/Part14_DigCh2-, sheet Part14/Output_ch2-
Part14_DigCh3+: sheet Processing/Part14_DigCh3+, sheet Part14/Output_ch3+
Part14_DigCh3-: sheet Processing/Part14_DigCh3-, sheet Part14/Output_ch3-
Part14_DigCh4+: sheet Processing/Part14_DigCh4+, sheet Part14/Output_ch4+
Part14_DigCh4-: sheet Processing/Part14_DigCh4-, sheet Part14/Output_ch4-
Part14_DigCh5+: sheet Processing/Part14_DigCh5+, sheet Part14/Output_ch5+
Part14_DigCh5-: sheet Processing/Part14_DigCh5-, sheet Part14/Output_ch5-
Part14_DigCh6+: sheet Processing/Part14_DigCh6+, sheet Part14/Output_ch6+
Part14_DigCh6-: sheet Processing/Part14_DigCh6-, sheet Part14/Output_ch6-
Part14_DigCh7+: sheet Processing/Part14_DigCh7+, sheet Part14/Output_ch7+
Part14_DigCh7-: sheet Processing/Part14_DigCh7-, sheet Part14/Output_ch7-
Part14_DigCh8+: sheet Processing/Part14_DigCh8+, sheet Part14/Output_ch8+
Part14_DigCh8-: sheet Processing/Part14_DigCh8-, sheet Part14/Output_ch8-
Part14_InputCh1+: sheet Designator/Part14_InputCh1+, sheet Part14/Input_ch1+
Part14_InputCh1-: sheet Designator/Part14_InputCh1-, sheet Part14/Input_ch1-
Part14_InputCh2+: sheet Designator/Part14_InputCh2+, sheet Part14/Input_ch2+
Part14_InputCh2-: sheet Designator/Part14_InputCh2-, sheet Part14/Input_ch2-
Part14_InputCh3+: sheet Designator/Part14_InputCh3+, sheet Part14/Input_ch3+
Part14_InputCh3-: sheet Designator/Part14_InputCh3-, sheet Part14/Input_ch3-
Part14_InputCh4+: sheet Designator/Part14_InputCh4+, sheet Part14/Input_ch4+
Part14_InputCh4-: sheet Designator/Part14_InputCh4-, sheet Part14/Input_ch4-
Part14_InputCh5+: sheet Designator/Part14_InputCh5+, sheet Part14/Input_ch5+
Part14_InputCh5-: sheet Designator/Part14_InputCh5-, sheet Part14/Input_ch5-
Part14_InputCh6+: sheet Designator/Part14_InputCh6+, sheet Part14/Input_ch6+
Part14_InputCh6-: sheet Designator/Part14_InputCh6-, sheet Part14/Input_ch6-
Part14_InputCh7+: sheet Designator/Part14_InputCh7+, sheet Part14/Input_ch7+
Part14_InputCh7-: sheet Designator/Part14_InputCh7-, sheet Part14/Input_ch7-
Part14_InputCh8+: sheet Designator/Part14_InputCh8+, sheet Part14/Input_ch8+
Part14_InputCh8-: sheet Designator/Part14_InputCh8-, sheet Part14/Input_ch8-
Part15_DigCh1+: sheet Processing/Part15_DigCh1+, sheet Part15/Output_ch1+
Part15_DigCh1-: sheet Processing/Part15_DigCh1-, sheet Part15/Output_ch1-
Part15_DigCh2+: sheet Processing/Part15_DigCh2+, sheet Part15/Output_ch2+
Part15_DigCh2-: sheet Processing/Part15_DigCh2-, sheet Part15/Output_ch2-
Part15_DigCh3+: sheet Processing/Part15_DigCh3+, sheet Part15/Output_ch3+
Part15_DigCh3-: sheet Processing/Part15_DigCh3-, sheet Part15/Output_ch3-
Part15_DigCh4+: sheet Processing/Part15_DigCh4+, sheet Part15/Output_ch4+
Part15_DigCh4-: sheet Processing/Part15_DigCh4-, sheet Part15/Output_ch4-
Part15_DigCh5+: sheet Processing/Part15_DigCh5+, sheet Part15/Output_ch5+
Part15_DigCh5-: sheet Processing/Part15_DigCh5-, sheet Part15/Output_ch5-
Part15_DigCh6+: sheet Processing/Part15_DigCh6+, sheet Part15/Output_ch6+
Part15_DigCh6-: sheet Processing/Part15_DigCh6-, sheet Part15/Output_ch6-
Part15_DigCh7+: sheet Processing/Part15_DigCh7+, sheet Part15/Output_ch7+
Part15_DigCh7-: sheet Processing/Part15_DigCh7-, sheet Part15/Output_ch7-
Part15_DigCh8+: sheet Processing/Part15_DigCh8+, sheet Part15/Output_ch8+
Part15_DigCh8-: sheet Processing/Part15_DigCh8-, sheet Part15/Output_ch8-
Part15_InputCh1+: sheet Designator/Part15_InputCh1+, sheet Part15/Input_ch1+
Part15_InputCh1-: sheet Designator/Part15_InputCh1-, sheet Part15/Input_ch1-
Part15_InputCh2+: sheet Designator/Part15_InputCh2+, sheet Part15/Input_ch2+
Part15_InputCh2-: sheet Designator/Part15_InputCh2-, sheet Part15/Input_ch2-
Part15_InputCh3+: sheet Designator/Part15_InputCh3+, sheet Part15/Input_ch3+
Part15_InputCh3-: sheet Designator/Part15_InputCh3-, sheet Part15/Input_ch3-
Part15_InputCh4+: sheet Designator/Part15_InputCh4+, sheet Part15/Input_ch4+
Part15_InputCh4-: sheet Designator/Part15_InputCh4-, sheet Part15/Input_ch4-
Part15_InputCh5+: sheet Designator/Part15_InputCh5+, sheet Part15/Input_ch5+
Part15_InputCh5-: sheet Designator/Part15_InputCh5-, sheet Part15/Input_ch5-
Part15_InputCh6+: sheet Designator/Part15_InputCh6+, sheet Part15/Input_ch6+
Part15_InputCh6-: sheet Designator/Part15_InputCh6-, sheet Part15/Input_ch6-
Part15_InputCh7+: sheet Designator/Part15_InputCh7+, sheet Part15/Input_ch7+
Part15_InputCh7-: sheet Designator/Part15_InputCh7-, sheet Part15/Input_ch7-
Part15_InputCh8+: sheet Designator/Part15_InputCh8+, sheet Part15/Input_ch8+
Part15_InputCh8-: sheet Designator/Part15_InputCh8-, sheet Part15/Input_ch8-
Part16_DigCh1+: sheet Processing/Part16_DigCh1+, sheet Part16/Output_ch1+
Part16_DigCh1-: sheet Processing/Part16_DigCh1-, sheet Part16/Output_ch1-
Part16_DigCh2+: sheet Processing/Part16_DigCh2+, sheet Part16/Output_ch2+
Part16_DigCh2-: sheet Processing/Part16_DigCh2-, sheet Part16/Output_ch2-
Part16_DigCh3+: sheet Processing/Part16_DigCh3+, sheet Part16/Output_ch3+
Part16_DigCh3-: sheet Processing/Part16_DigCh3-, sheet Part16/Output_ch3-
Part16_DigCh4+: sheet Processing/Part16_DigCh4+, sheet Part16/Output_ch4+
Part16_DigCh4-: sheet Processing/Part16_DigCh4-, sheet Part16/Output_ch4-
Part16_DigCh5+: sheet Processing/Part16_DigCh5+, sheet Part16/Output_ch5+
Part16_DigCh5-: sheet Processing/Part16_DigCh5-, sheet Part16/Output_ch5-
Part16_DigCh6+: sheet Processing/Part16_DigCh6+, sheet Part16/Output_ch6+
Part16_DigCh6-: sheet Processing/Part16_DigCh6-, sheet Part16/Output_ch6-
Part16_DigCh7+: sheet Processing/Part16_DigCh7+, sheet Part16/Output_ch7+
Part16_DigCh7-: sheet Processing/Part16_DigCh7-, sheet Part16/Output_ch7-
Part16_DigCh8+: sheet Processing/Part16_DigCh8+, sheet Part16/Output_ch8+
Part16_DigCh8-: sheet Processing/Part16_DigCh8-, sheet Part16/Output_ch8-
Part16_InputCh1+: sheet Designator/Part16_InputCh1+, sheet Part16/Input_ch1+
Part16_InputCh1-: sheet Designator/Part16_InputCh1-, sheet Part16/Input_ch1-
Part16_InputCh2+: sheet Designator/Part16_InputCh2+, sheet Part16/Input_ch2+
Part16_InputCh2-: sheet Designator/Part16_InputCh2-, sheet Part16/Input_ch2-
Part16_InputCh3+: sheet Designator/Part16_InputCh3+, sheet Part16/Input_ch3+
Part16_InputCh3-: sheet Designator/Part16_InputCh3-, sheet Part16/Input_ch3-
Part16_InputCh4+: sheet Designator/Part16_InputCh4+, sheet Part16/Input_ch4+
Part16_InputCh4-: sheet Designator/Part16_InputCh4-, sheet Part16/Input_ch4-
Part16_InputCh5+: sheet Designator/Part16_InputCh5+, sheet Part16/Input_ch5+
Part16_InputCh5-: sheet Designator/Part16_InputCh5-, sheet Part16/Input_ch5-
Part16_InputCh6+: sheet Designator/Part16_InputCh6+, sheet Part16/Input_ch6+
Part16_InputCh6-: sheet Designator/Part16_InputCh6-, sheet Part16/Input_ch6-
Part16_InputCh7+: sheet Designator/Part16_InputCh7+, sheet Part16/Input_ch7+
Part16_InputCh7-: sheet Designator/Part16_InputCh7-, sheet Part16/Input_ch7-
Part16_InputCh8+: sheet Designator/Part16_InputCh8+, sheet Part16/Input_ch8+
Part16_InputCh8-: sheet Designator/Part16_InputCh8-, sheet Part16/Input_ch8-
Part17_DigCh1+: sheet Processing/Part17_DigCh1+, sheet Part17/Output_ch1+
Part17_DigCh1-: sheet Processing/Part17_DigCh1-, sheet Part17/Output_ch1-
Part17_DigCh2+: sheet Processing/Part17_DigCh2+, sheet Part17/Output_ch2+
Part17_DigCh2-: sheet Processing/Part17_DigCh2-, sheet Part17/Output_ch2-
Part17_DigCh3+: sheet Processing/Part17_DigCh3+, sheet Part17/Output_ch3+
Part17_DigCh3-: sheet Processing/Part17_DigCh3-, sheet Part17/Output_ch3-
Part17_DigCh4+: sheet Processing/Part17_DigCh4+, sheet Part17/Output_ch4+
Part17_DigCh4-: sheet Processing/Part17_DigCh4-, sheet Part17/Output_ch4-
Part17_DigCh5+: sheet Processing/Part17_DigCh5+, sheet Part17/Output_ch5+
Part17_DigCh5-: sheet Processing/Part17_DigCh5-, sheet Part17/Output_ch5-
Part17_DigCh6+: sheet Processing/Part17_DigCh6+, sheet Part17/Output_ch6+
Part17_DigCh6-: sheet Processing/Part17_DigCh6-, sheet Part17/Output_ch6-
Part17_DigCh7+: sheet Processing/Part17_DigCh7+, sheet Part17/Output_ch7+
Part17_DigCh7-: sheet Processing/Part17_DigCh7-, sheet Part17/Output_ch7-
Part17_DigCh8+: sheet Processing/Part17_DigCh8+, sheet Part17/Output_ch8+
Part17_DigCh8-: sheet Processing/Part17_DigCh8-, sheet Part17/Output_ch8-
Part17_InputCh1+: sheet Designator/Part17_InputCh1+, sheet Part17/Input_ch1+
Part17_InputCh1-: sheet Designator/Part17_InputCh1-, sheet Part17/Input_ch1-
Part17_InputCh2+: sheet Designator/Part17_InputCh2+, sheet Part17/Input_ch2+
Part17_InputCh2-: sheet Designator/Part17_InputCh2-, sheet Part17/Input_ch2-
Part17_InputCh3+: sheet Designator/Part17_InputCh3+, sheet Part17/Input_ch3+
Part17_InputCh3-: sheet Designator/Part17_InputCh3-, sheet Part17/Input_ch3-
Part17_InputCh4+: sheet Designator/Part17_InputCh4+, sheet Part17/Input_ch4+
Part17_InputCh4-: sheet Designator/Part17_InputCh4-, sheet Part17/Input_ch4-
Part17_InputCh5+: sheet Designator/Part17_InputCh5+, sheet Part17/Input_ch5+
Part17_InputCh5-: sheet Designator/Part17_InputCh5-, sheet Part17/Input_ch5-
Part17_InputCh6+: sheet Designator/Part17_InputCh6+, sheet Part17/Input_ch6+
Part17_InputCh6-: sheet Designator/Part17_InputCh6-, sheet Part17/Input_ch6-
Part17_InputCh7+: sheet Designator/Part17_InputCh7+, sheet Part17/Input_ch7+
Part17_InputCh7-: sheet Designator/Part17_InputCh7-, sheet Part17/Input_ch7-
Part17_InputCh8+: sheet Designator/Part17_InputCh8+, sheet Part17/Input_ch8+
Part17_InputCh8-: sheet Designator/Part17_InputCh8-, sheet Part17/Input_ch8-
Part18_DigCh1+: sheet Processing/Part18_DigCh1+, sheet Part18/Output_ch1+
Part18_DigCh1-: sheet Processing/Part18_DigCh1-, sheet Part18/Output_ch1-
Part18_DigCh2+: sheet Processing/Part18_DigCh2+, sheet Part18/Output_ch2+
Part18_DigCh2-: sheet Processing/Part18_DigCh2-, sheet Part18/Output_ch2-
Part18_DigCh3+: sheet Processing/Part18_DigCh3+, sheet Part18/Output_ch3+
Part18_DigCh3-: sheet Processing/Part18_DigCh3-, sheet Part18/Output_ch3-
Part18_DigCh4+: sheet Processing/Part18_DigCh4+, sheet Part18/Output_ch4+
Part18_DigCh4-: sheet Processing/Part18_DigCh4-, sheet Part18/Output_ch4-
Part18_DigCh5+: sheet Processing/Part18_DigCh5+, sheet Part18/Output_ch5+
Part18_DigCh5-: sheet Processing/Part18_DigCh5-, sheet Part18/Output_ch5-
Part18_DigCh6+: sheet Processing/Part18_DigCh6+, sheet Part18/Output_ch6+
Part18_DigCh6-: sheet Processing/Part18_DigCh6-, sheet Part18/Output_ch6-
Part18_DigCh7+: sheet Processing/Part18_DigCh7+, sheet Part18/Output_ch7+
Part18_DigCh7-: sheet Processing/Part18_DigCh7-, sheet Part18/Output_ch7-
Part18_DigCh8+: sheet Processing/Part18_DigCh8+, sheet Part18/Output_ch8+
Part18_DigCh8-: sheet Processing/Part18_DigCh8-, sheet Part18/Output_ch8-
Part18_InputCh1+: sheet Designator/Part18_InputCh1+, sheet Part18/Input_ch1+
Part18_InputCh1-: sheet Designator/Part18_InputCh1-, sheet Part18/Input_ch1-
Part18_InputCh2+: sheet Designator/Part18_InputCh2+, sheet Part18/Input_ch2+
Part18_InputCh2-: sheet Designator/Part18_InputCh2-, sheet Part18/Input_ch2-
Part18_InputCh3+: sheet Designator/Part18_InputCh3+, sheet Part18/Input_ch3+
Part18_InputCh3-: sheet Designator/Part18_InputCh3-, sheet Part18/Input_ch3-
Part18_InputCh4+: sheet Designator/Part18_InputCh4+, sheet Part18/Input_ch4+
Part18_InputCh4-: sheet Designator/Part18_InputCh4-, sheet Part18/Input_ch4-
Part18_InputCh5+: sheet Designator/Part18_InputCh5+, sheet Part18/Input_ch5+
Part18_InputCh5-: sheet Designator/Part18_InputCh5-, sheet Part18/Input_ch5-
Part18_InputCh6+: sheet Designator/Part18_InputCh6+, sheet Part18/Input_ch6+
Part18_InputCh6-: sheet Designator/Part18_InputCh6-, sheet Part18/Input_ch6-
Part18_InputCh7+: sheet Designator/Part18_InputCh7+, sheet Part18/Input_ch7+
Part18_InputCh7-: sheet Designator/Part18_InputCh7-, sheet Part18/Input_ch7-
Part18_InputCh8+: sheet Designator/Part18_InputCh8+, sheet Part18/Input_ch8+
Part18_InputCh8-: sheet Designator/Part18_InputCh8-, sheet Part18/Input_ch8-
Part19_DigCh1+: sheet Processing/Part19_DigCh1+, sheet Part19/Output_ch1+
Part19_DigCh1-: sheet Processing/Part19_DigCh1-, sheet Part19/Output_ch1-
Part19_DigCh2+: sheet Processing/Part19_DigCh2+, sheet Part19/Output_ch2+
Part19_DigCh2-: sheet Processing/Part19_DigCh2-, sheet Part19/Output_ch2-
Part19_DigCh3+: sheet Processing/Part19_DigCh3+, sheet Part19/Output_ch3+
Part19_DigCh3-: sheet Processing/Part19_DigCh3-, sheet Part19/Output_ch3-
Part19_DigCh4+: sheet Processing/Part19_DigCh4+, sheet Part19/Output_ch4+
Part19_DigCh4-: sheet Processing/Part19_DigCh4-, sheet Part19/Output_ch4-
Part19_DigCh5+: sheet Processing/Part19_DigCh5+, sheet Part19/Output_ch5+
Part19_DigCh5-: sheet Processing/Part19_DigCh5-, sheet Part19/Output_ch5-
Part19_DigCh6+: sheet Processing/Part19_DigCh6+, sheet Part19/Output_ch6+
Part19_DigCh6-: sheet Processing/Part19_DigCh6-, sheet Part19/Output_ch6-
Part19_DigCh7+: sheet Processing/Part19_DigCh7+, sheet Part19/Output_ch7+
Part19_DigCh7-: sheet Processing/Part19_DigCh7-, sheet Part19/Output_ch7-
Part19_DigCh8+: sheet Processing/Part19_DigCh8+, sheet Part19/Output_ch8+
Part19_DigCh8-: sheet Processing/Part19_DigCh8-, sheet Part19/Output_ch8-
Part19_InputCh1+: sheet Designator/Part19_InputCh1+, sheet Part19/Input_ch1+
Part19_InputCh1-: sheet Designator/Part19_InputCh1-, sheet Part19/Input_ch1-
Part19_InputCh2+: sheet Designator/Part19_InputCh2+, sheet Part19/Input_ch2+
Part19_InputCh2-: sheet Designator/Part19_InputCh2-, sheet Part19/Input_ch2-
Part19_InputCh3+: sheet Designator/Part19_InputCh3+, sheet Part19/Input_ch3+
Part19_InputCh3-: sheet Designator/Part19_InputCh3-, sheet Part19/Input_ch3-
Part19_InputCh4+: sheet Designator/Part19_InputCh4+, sheet Part19/Input_ch4+
Part19_InputCh4-: sheet Designator/Part19_InputCh4-, sheet Part19/Input_ch4-
Part19_InputCh5+: sheet Designator/Part19_InputCh5+, sheet Part19/Input_ch5+
Part19_InputCh5-: sheet Designator/Part19_InputCh5-, sheet Part19/Input_ch5-
Part19_InputCh6+: sheet Designator/Part19_InputCh6+, sheet Part19/Input_ch6+
Part19_InputCh6-: sheet Designator/Part19_InputCh6-, sheet Part19/Input_ch6-
Part19_InputCh7+: sheet Designator/Part19_InputCh7+, sheet Part19/Input_ch7+
Part19_InputCh7-: sheet Designator/Part19_InputCh7-, sheet Part19/Input_ch7-
Part19_InputCh8+: sheet Designator/Part19_InputCh8+, sheet Part19/Input_ch8+
Part19_InputCh8-: sheet Designator/Part19_InputCh8-, sheet Part19/Input_ch8-
Part20_DigCh1+: sheet Processing/Part20_DigCh1+, sheet Part20/Output_ch1+
Part20_DigCh1-: sheet Processing/Part20_DigCh1-, sheet Part20/Output_ch1-
Part20_DigCh2+: sheet Processing/Part20_DigCh2+, sheet Part20/Output_ch2+
Part20_DigCh2-: sheet Processing/Part20_DigCh2-, sheet Part20/Output_ch2-
Part20_DigCh3+: sheet Processing/Part20_DigCh3+, sheet Part20/Output_ch3+
Part20_DigCh3-: sheet Processing/Part20_DigCh3-, sheet Part20/Output_ch3-
Part20_DigCh4+: sheet Processing/Part20_DigCh4+, sheet Part20/Output_ch4+
Part20_DigCh4-: sheet Processing/Part20_DigCh4-, sheet Part20/Output_ch4-
Part20_DigCh5+: sheet Processing/Part20_DigCh5+, sheet Part20/Output_ch5+
Part20_DigCh5-: sheet Processing/Part20_DigCh5-, sheet Part20/Output_ch5-
Part20_DigCh6+: sheet Processing/Part20_DigCh6+, sheet Part20/Output_ch6+
Part20_DigCh6-: sheet Processing/Part20_DigCh6-, sheet Part20/Output_ch6-
Part20_DigCh7+: sheet Processing/Part20_DigCh7+, sheet Part20/Output_ch7+
Part20_DigCh7-: sheet Processing/Part20_DigCh7-, sheet Part20/Output_ch7-
Part20_DigCh8+: sheet Processing/Part20_DigCh8+, sheet Part20/Output_ch8+
Part20_DigCh8-: sheet Processing/Part20_DigCh8-, sheet Part20/Output_ch8-
Part20_InputCh1+: sheet Designator/Part20_InputCh1+, sheet Part20/Input_ch1+
Part20_InputCh1-: sheet Designator/Part20_InputCh1-, sheet Part20/Input_ch1-
Part20_InputCh2+: sheet Designator/Part20_InputCh2+, sheet Part20/Input_ch2+
Part20_InputCh2-: sheet Designator/Part20_InputCh2-, sheet Part20/Input_ch2-
Part20_InputCh3+: sheet Designator/Part20_InputCh3+, sheet Part20/Input_ch3+
Part20_InputCh3-: sheet Designator/Part20_InputCh3-, sheet Part20/Input_ch3-
Part20_InputCh4+: sheet Designator/Part20_InputCh4+, sheet Part20/Input_ch4+
Part20_InputCh4-: sheet Designator/Part20_InputCh4-, sheet Part20/Input_ch4-
Part20_InputCh5+: sheet Designator/Part20_InputCh5+, sheet Part20/Input_ch5+
Part20_InputCh5-: sheet Designator/Part20_InputCh5-, sheet Part20/Input_ch5-
Part20_InputCh6+: sheet Designator/Part20_InputCh6+, sheet Part20/Input_ch6+
Part20_InputCh6-: sheet Designator/Part20_InputCh6-, sheet Part20/Input_ch6-
Part20_InputCh7+: sheet Designator/Part20_InputCh7+, sheet Part20/Input_ch7+
Part20_InputCh7-: sheet Designator/Part20_InputCh7-, sheet Part20/Input_ch7-
Part20_InputCh8+: sheet Designator/Part20_InputCh8+, sheet Part20/Input_ch8+
Part20_InputCh8-: sheet Designator/Part20_InputCh8-, sheet Part20/Input_ch8-
SCLK: sheet Part1/SCLK, sheet Part5/SCLK, sheet Part9/SCLK, sheet Part13/SCLK, sheet Part17/SCLK, sheet Part2/SCLK, sheet Part6/SCLK, sheet Part10/SCLK, sheet Part14/SCLK, sheet Part18/SCLK, sheet Part3/SCLK, sheet Part7/SCLK, sheet Part11/SCLK, sheet Part15/SCLK, sheet Part19/SCLK, sheet Part4/SCLK, sheet Part8/SCLK, sheet Part12/SCLK, sheet Part16/SCLK, sheet Part20/SCLK
SDIO/ODM: sheet Part1/SDIO/ODM, sheet Part5/SDIO/ODM, sheet Part9/SDIO/ODM, sheet Part13/SDIO/ODM, sheet Part17/SDIO/ODM, sheet Part2/SDIO/ODM, sheet Part6/SDIO/ODM, sheet Part10/SDIO/ODM, sheet Part14/SDIO/ODM, sheet Part18/SDIO/ODM, sheet Part3/SDIO/ODM, sheet Part7/SDIO/ODM, sheet Part11/SDIO/ODM, sheet Part15/SDIO/ODM, sheet Part19/SDIO/ODM, sheet Part4/SDIO/ODM, sheet Part8/SDIO/ODM, sheet Part12/SDIO/ODM, sheet Part16/SDIO/ODM, sheet Part20/SDIO/ODM